# EAGLE design carte puissance 4PMOS (EAGLE 7.6.0)
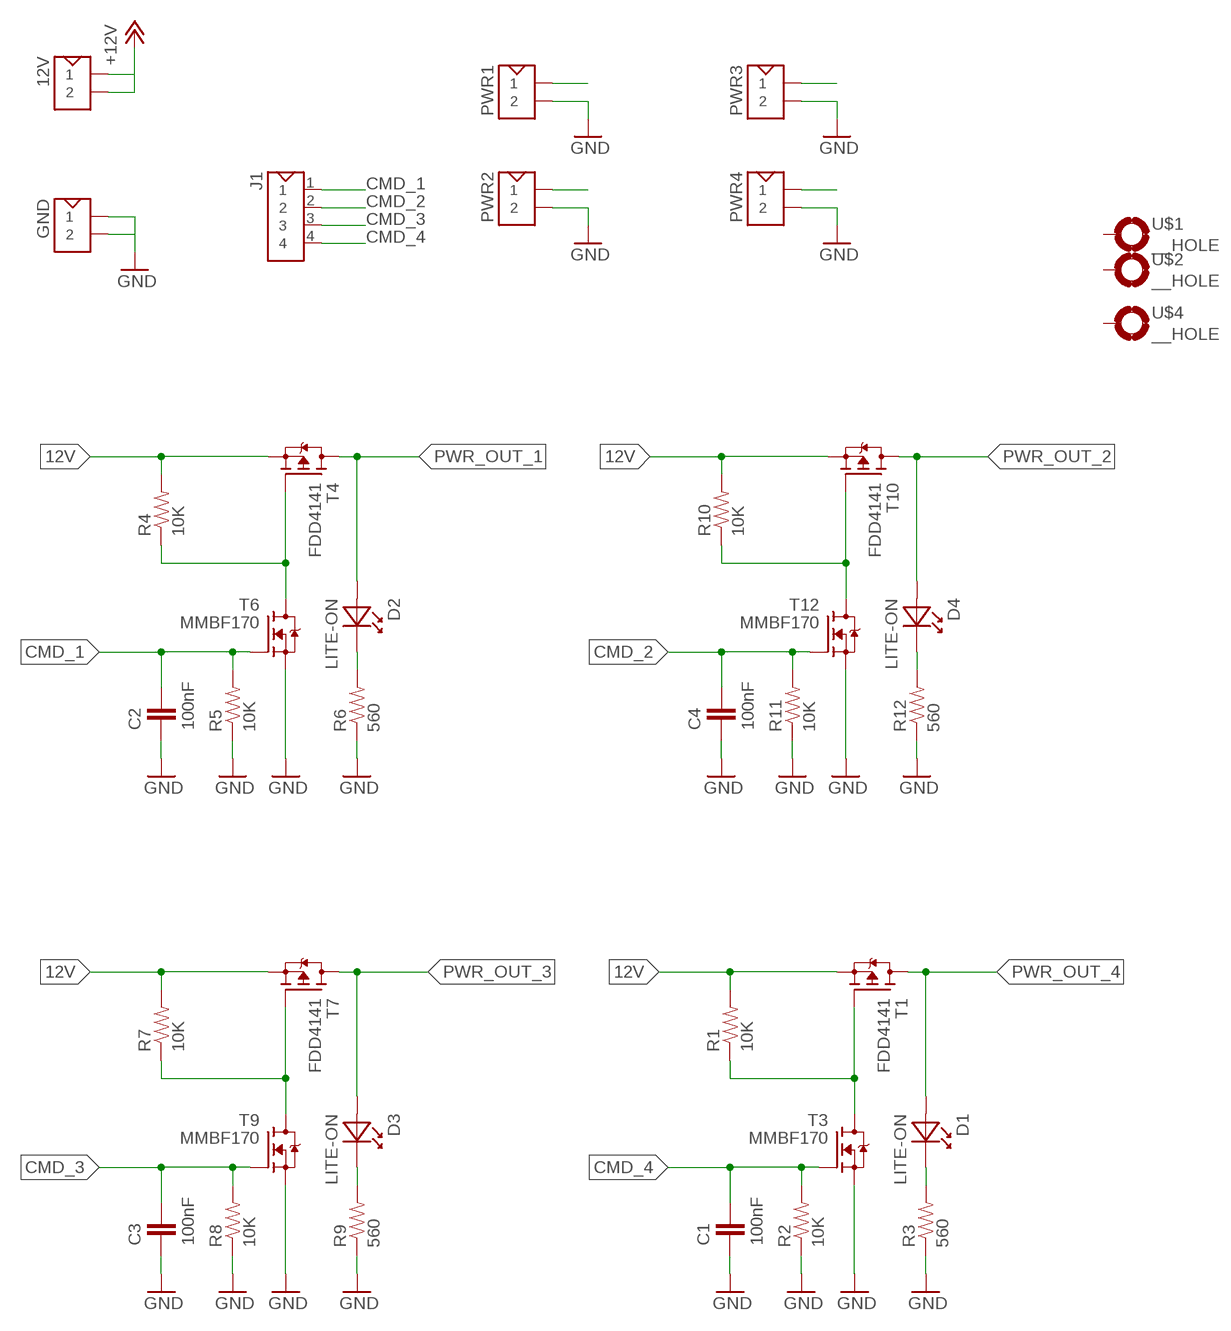
[diagram p0: schematic, sheet 1]

## Parts
12V  CON_2_BORNIER_A  [GMKDS_3_2-7.62]
C1  100nF  CAP0805  [0805]
C2  100nF  CAP0805  [0805]
C3  100nF  CAP0805  [0805]
C4  100nF  CAP0805  [0805]
D1  LITE-ON  LITE-ON_LTST-C170  [LITE-ON_LTST-C170]
D2  LITE-ON  LITE-ON_LTST-C170  [LITE-ON_LTST-C170]
D3  LITE-ON  LITE-ON_LTST-C170  [LITE-ON_LTST-C170]
D4  LITE-ON  LITE-ON_LTST-C170  [LITE-ON_LTST-C170]
GND  CON_2_BORNIER_A  [GMKDS_3_2-7.62]
J1  CON_4_JST  [B04B-XASK-1]
PWR1  CON_2_RS-PRO  [8971262]
PWR2  CON_2_RS-PRO  [8971262]
PWR3  CON_2_RS-PRO  [8971262]
PWR4  CON_2_RS-PRO  [8971262]
R1  10K  RESISTOR0805-RES  [0805]
R2  10K  RESISTOR0805-RES  [0805]
R3  560  RESISTOR0805-RES  [0805]
R4  10K  RESISTOR0805-RES  [0805]
R5  10K  RESISTOR0805-RES  [0805]
R6  560  RESISTOR0805-RES  [0805]
R7  10K  RESISTOR0805-RES  [0805]
R8  10K  RESISTOR0805-RES  [0805]
R9  560  RESISTOR0805-RES  [0805]
R10  10K  RESISTOR0805-RES  [0805]
R11  10K  RESISTOR0805-RES  [0805]
R12  560  RESISTOR0805-RES  [0805]
T1  FDD4141  PMOSFET_FDD4141  [D-PAC]
T3  MMBF170  NMOSFET_MMBF170LT1G  [SOT23]
T4  FDD4141  PMOSFET_FDD4141  [D-PAC]
T6  MMBF170  NMOSFET_MMBF170LT1G  [SOT23]
T7  FDD4141  PMOSFET_FDD4141  [D-PAC]
T9  MMBF170  NMOSFET_MMBF170LT1G  [SOT23]
T10  FDD4141  PMOSFET_FDD4141  [D-PAC]
T12  MMBF170  NMOSFET_MMBF170LT1G  [SOT23]
U$1  __HOLE  [__HOLE]
U$2  __HOLE  [__HOLE]
U$4  __HOLE  [__HOLE]

## Nets
12V: 12V.P$1 12V.P$2 R1.2 R4.2 R7.2 R10.2 T1.3(S) T4.3(S) T7.3(S) T10.3(S) ; supply symbol labelled +12V
CMD_1: C2.1 J1.1 R5.2 T6.1(G)
CMD_2: C4.1 J1.2 R11.2 T12.1(G)
CMD_3: C3.1 J1.3 R8.2 T9.1(G)
CMD_4: C1.1 J1.4 R2.2 T3.1(G)
GND: C1.2 C2.2 C3.2 C4.2 GND.P$1 GND.P$2 PWR1.2 PWR2.2 PWR3.2 PWR4.2 R2.1 R3.1 R5.1 R6.1 R8.1 R9.1 R11.1 R12.1 T3.2(S) T6.2(S) T9.2(S) T12.2(S)
N$1: R1.1 T1.1(G) T3.3(D)
N$3: D1.2(CATODE) R3.2
N$4: R4.1 T4.1(G) T6.3(D)
N$5: R7.1 T7.1(G) T9.3(D)
N$7: D3.2(CATODE) R9.2
N$9: D2.2(CATODE) R6.2
N$10: R10.1 T10.1(G) T12.3(D)
N$12: D4.2(CATODE) R12.2
PWR_OUT_1: D2.1(ANODE) PWR1.1 T4.4(D)
PWR_OUT_2: D4.1(ANODE) PWR2.1 T10.4(D)
PWR_OUT_3: D3.1(ANODE) PWR3.1 T7.4(D)
PWR_OUT_4: D1.1(ANODE) PWR4.1 T1.4(D)
Unconnected: U$1.P$1(MOUNT) U$1.P$2(MOUNT) U$1.P$3(MOUNT) U$1.P$4(MOUNT) U$1.P$5(MOUNT) U$1.P$6(MOUNT) U$1.P$7(MOUNT) U$1.P$8(MOUNT) U$1.P$9(MOUNT) U$2.P$1(MOUNT) U$2.P$2(MOUNT) U$2.P$3(MOUNT) U$2.P$4(MOUNT) U$2.P$5(MOUNT) U$2.P$6(MOUNT) U$2.P$7(MOUNT) U$2.P$8(MOUNT) U$2.P$9(MOUNT) U$4.P$1(MOUNT) U$4.P$2(MOUNT) U$4.P$3(MOUNT) U$4.P$4(MOUNT) U$4.P$5(MOUNT) U$4.P$6(MOUNT) U$4.P$7(MOUNT) U$4.P$8(MOUNT) U$4.P$9(MOUNT)

## Library data of the parts
12V GND = VALEO Proto Components:CON_2
C1-C4 = SparkFun:CAP: Capacitor Standard 0603 ceramic capacitor, and 0.1" leaded capacitor.
D1-D4 = VALEO Proto LEDs:LITE-ON_LTST-C170
J1 = V_PR_CONNECTORS:CON_4; RS: 602-7635
PWR1-PWR4 = V_PR_CONNECTORS:CON_2; RS: 897-1262 / (897-1219)
R1-R12 = SparkFun:RESISTOR: Resistor Basic schematic elements and footprints for 0603, 1206, and PTH resistors.
T1 T4 T7 T10 = VALEO Proto Components:PMOSFET
T3 T6 T9 T12 = VALEO Proto Components:NMOSFET
U$1 U$2 U$4 = VALEO Proto Components:__HOLE

## Board
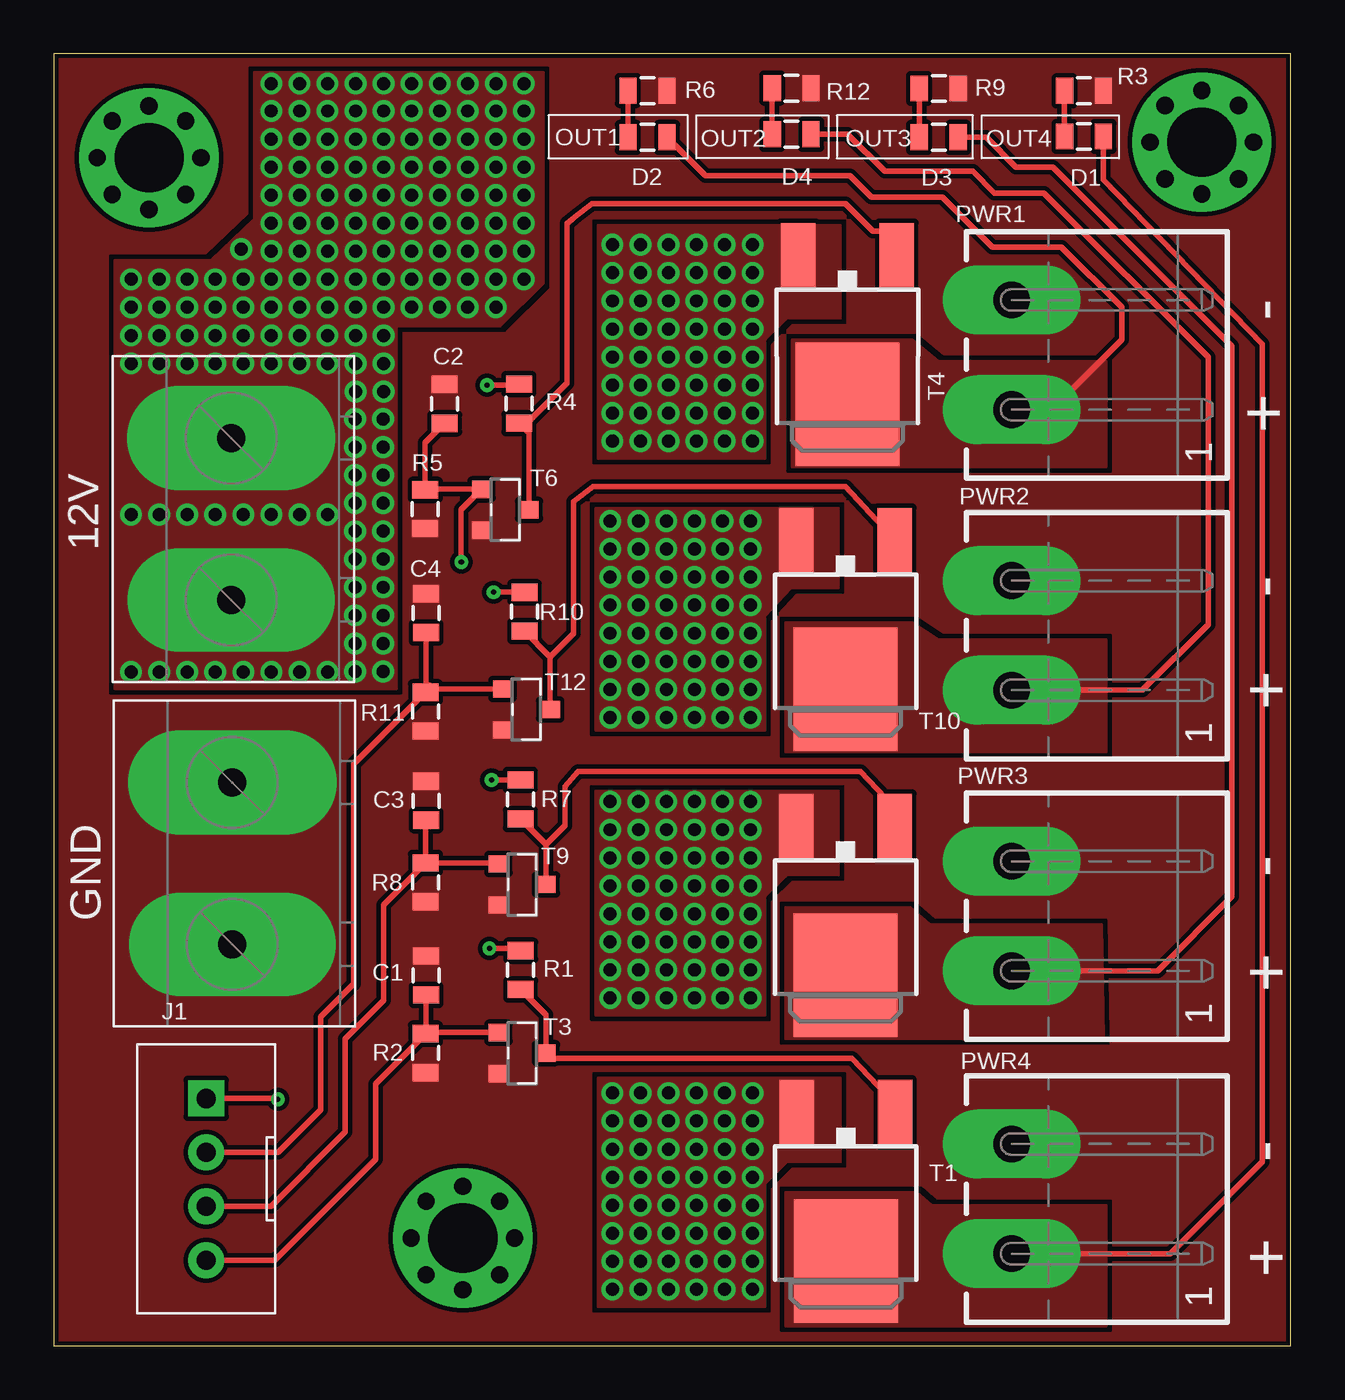
[diagram p1: board, top side]
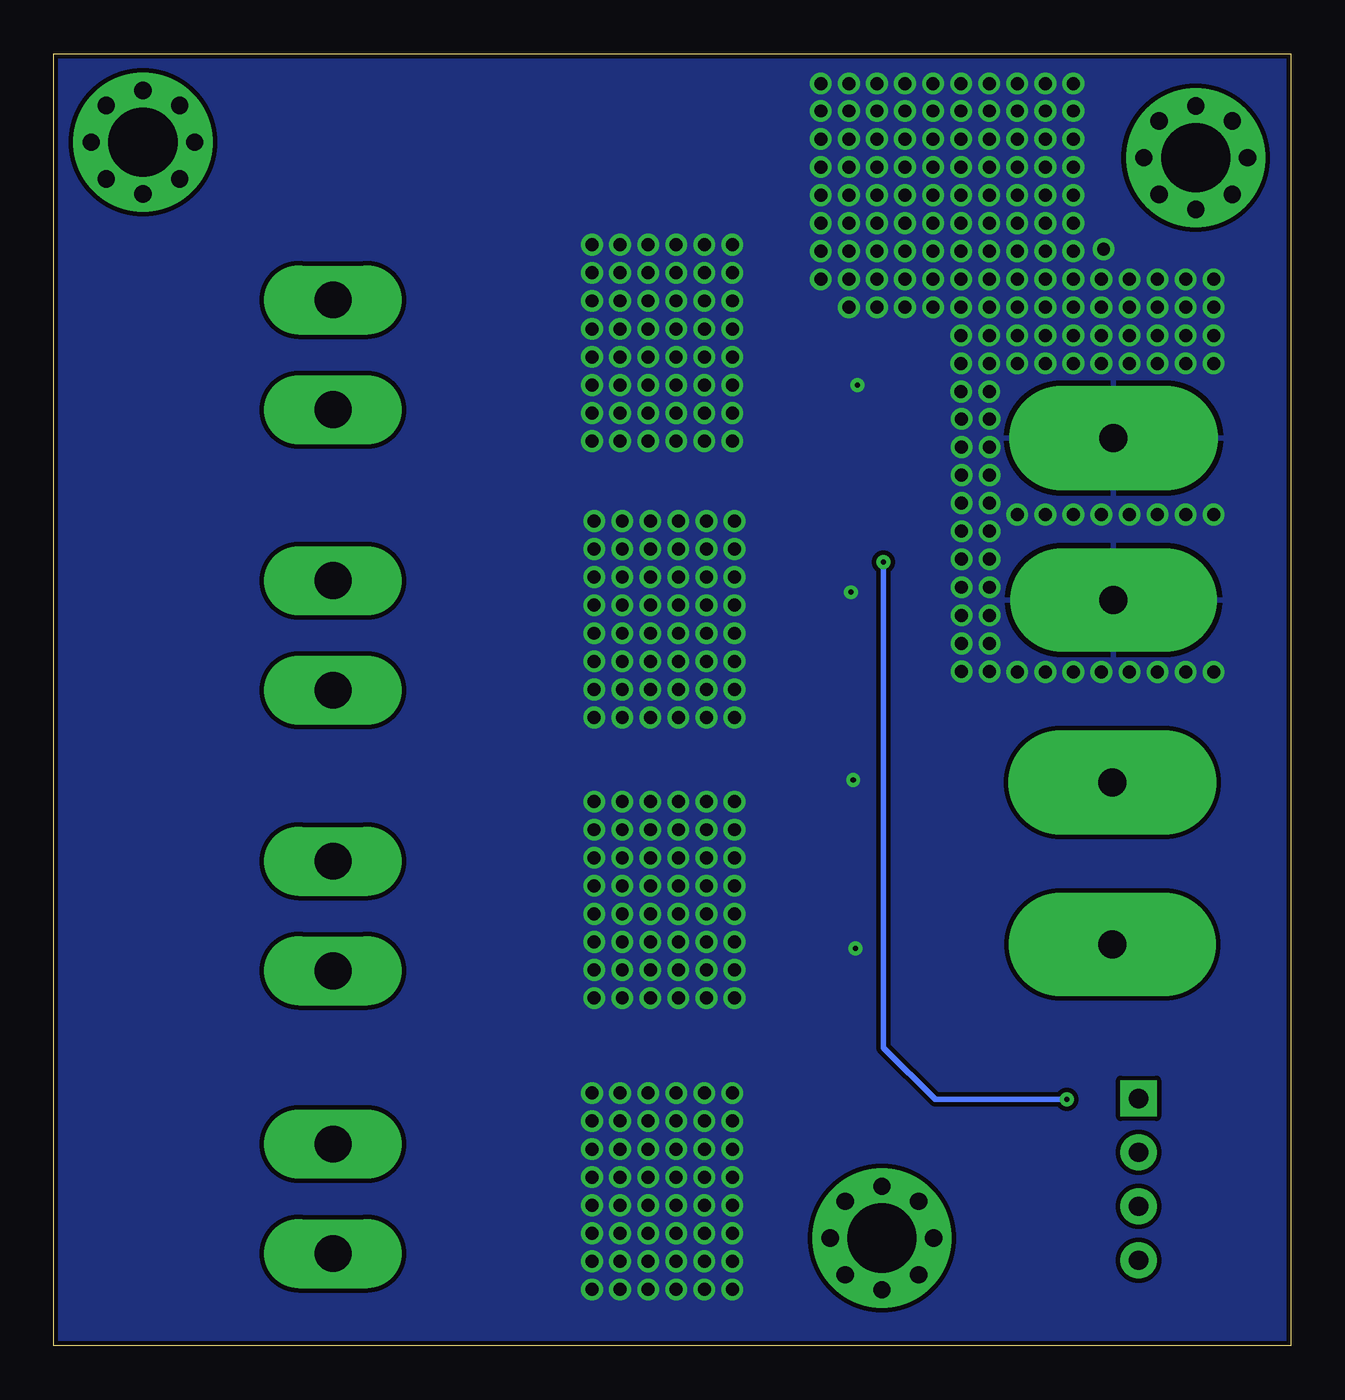
[diagram p2: board, bottom side, seen from below]

Size 57.3 x 59.84 mm. Coordinates in mm from the lower left corner, seen from the top.
Outline: 0,0 57.3,0 57.3,59.84 0,59.84 0,0
Copper layers (1*16): Top 0.07mm / dielectric 1mm / Bottom 0.07mm
Design rules "DRC_CL4 *": minimum track width 0.21mm, minimum drill 0.2mm, track to track 0.21mm, track to pad 0.21mm, pad to pad 0.21mm, via to via 0.21mm, smd to smd 0.21mm, copper to edge 0.21mm, drill to drill 0.21mm, minimum pad ring 10mil, minimum via ring 8mil, stop-mask expansion 4mil, vias tented up to drill 0mil, thermal gap 10mil

### Footprints (pad centres in the part's own frame; a part is rotated, then mirrored left to right if it is on the bottom)
GMKDS_3_2-7.62 = drill 1.3 pad 4.83 long: P$1 -3.8,0 | drill 1.3 pad 4.8 long: P$2 3.7,0
0805 = smd 0.8 x 1.2: 1 -0.9,0; 2 0.9,0
LITE-ON_LTST-C170 = smd 0.8 x 1.2: 1 -0.9,0; 2 0.9,0
B04B-XASK-1 = drill 0.9 pad 1.676 square: 1 -3.25,0 | drill 0.9 pad 1.676: 2 -0.75,0; 3 1.75,0; 4 4.25,0
8971262 = drill 1.7 pad 3.2 long: 1 -2.54,0; 2 2.54,0
D-PAC = smd 1.6 x 3: 1 -2.28,-4.04; 3 2.28,-4.04 | smd 4.826 x 5.715: 4 0,2.858
SOT23 = smd 0.8 x 0.9: 1 -0.95,-1.1; 2 0.95,-1.1; 3 0,1.1
__HOLE = drill 3.2 pad 6.452: P$1 0,0 | drill 0.8: P$2 0,2.4; P$3 1.7,1.7; P$4 2.4,0; P$5 0,-2.4; P$6 1.7,-1.7; P$7 -2.4,0; P$8 -1.7,1.7; P$9 -1.7,-1.7

### Placement (x,y rotation side)
12V  8.21,38.25 270 top
C1  17.24,17.15 90 top
C2  18.1,43.63 90 top
C3  17.24,25.24 90 top
C4  17.24,33.93 90 top
D1  47.72,56.02 180 top
D2  27.5,55.98 180 top
D3  40.99,55.98 180 top
D4  34.17,56.12 180 top
GND  8.26,22.29 270 top
J1  7.05,8.2 270 top
PWR1  44.37,45.9 90 top
PWR2  44.37,32.9 90 top
PWR3  44.37,19.9 90 top
PWR4  44.37,6.8 90 top
R1  21.62,17.4 90 top
R2  17.21,13.55 90 top
R3  47.72,58.13 180 top
R4  21.54,43.64 90 top
R5  17.2,38.75 90 top
R6  27.5,58.14 180 top
R7  21.61,25.3 90 top
R8  17.21,21.46 90 top
R9  40.99,58.24 180 top
R10  21.8,34 90 top
R11  17.21,29.37 90 top
R12  34.17,58.26 180 top
T1  36.69,6.77 180 top
T3  21.69,13.55 270 top
T4  36.76,46.47 180 top
T6  20.91,38.72 270 top
T7  36.67,20.02 180 top
T9  21.69,21.36 270 top
T10  36.67,33.27 180 top
T12  21.89,29.47 270 top
U$1  4.4,55.03 0 top
U$2  53.18,55.75 0 top
U$4  18.94,4.98 0 top

### Tracks (layer width: path | path; a pad name or v marks a point on that pad's centre or on a via)
12V  (via drill 0.23, 0.6 pad 0.81)
  Top 0.254: v20.07,44.5 21.5,44.5 R4.2 | v20.37,34.9 R10.2 | v20.27,26.2 R7.2 | v20.17,18.4 21.52,18.4 R1.2
  other vias: 15.27,53.3 10.07,53.3 11.37,53.3 12.67,53.3 13.97,53.3 10.07,54.6 11.37,54.6 12.67,54.6 13.97,54.6 15.27,54.6 10.07,55.9 11.37,55.9 12.67,55.9 13.97,55.9 15.27,55.9 10.07,57.2 11.37,57.2 12.67,57.2 13.97,57.2 15.27,57.2 21.77,50.7 16.57,50.7 17.87,50.7 19.17,50.7 20.47,50.7 16.57,52 17.87,52 19.17,52 20.47,52 21.77,52 15.27,50.7 11.37,50.7 12.67,50.7 13.97,50.7 10.07,52 11.37,52 12.67,52 13.97,52 15.27,52 21.77,53.3 16.57,53.3 17.87,53.3 19.17,53.3 20.47,53.3 16.57,54.6 17.87,54.6 19.17,54.6 20.47,54.6 21.77,54.6 16.57,55.9 17.87,55.9 19.17,55.9 20.47,55.9 21.77,55.9 16.57,57.2 17.87,57.2 19.17,57.2 20.47,57.2 21.77,57.2 21.77,49.4 16.57,49.4 17.87,49.4 19.17,49.4 20.47,49.4 15.27,49.4 13.97,49.4 16.57,48.1 17.87,48.1 19.17,48.1 20.47,48.1 15.27,48.1 13.97,48.1 15.27,46.8 13.97,46.8 15.27,45.5 13.97,45.5 15.27,44.2 13.97,44.2 10.07,50.7 8.67,50.8 6.17,45.5 3.57,45.5 4.87,45.5 3.57,46.8 4.87,46.8 6.17,46.8 3.57,48.1 4.87,48.1 6.17,48.1 3.57,49.4 4.87,49.4 6.17,49.4 12.67,45.5 7.47,45.5 8.77,45.5 10.07,45.5 11.37,45.5 7.47,46.8 8.77,46.8 10.07,46.8 11.37,46.8 12.67,46.8 7.47,48.1 8.77,48.1 10.07,48.1 11.37,48.1 12.67,48.1 7.47,49.4 8.77,49.4 10.07,49.4 11.37,49.4 12.67,49.4 3.57,38.5 4.87,38.5 6.17,38.5 7.47,38.5 8.77,38.5 10.07,38.5 11.37,38.5 15.25,39.03 13.95,39.03 13.95,40.33 15.25,40.33 13.95,41.63 15.25,41.63 13.95,42.93 15.25,42.93 15.25,36.43 13.95,36.43 13.95,37.73 15.25,37.73 15.25,35.13 13.95,35.13 15.25,33.83 13.95,33.83 15.25,32.53 13.95,32.53 15.25,31.23 13.95,31.23 12.67,38.5 3.57,31.2 4.87,31.2 6.17,31.2 7.47,31.2 8.77,31.2 10.07,31.2 11.37,31.2 12.67,31.2 27.17,7.8 25.87,7.8 25.87,9.1 27.17,9.1 25.87,10.4 27.17,10.4 25.87,11.7 27.17,11.7 28.47,5.2 29.77,5.2 31.07,5.2 32.37,5.2 28.47,6.5 29.77,6.5 31.07,6.5 32.37,6.5 27.17,5.2 25.87,5.2 25.87,6.5 27.17,6.5 28.47,7.8 29.77,7.8 31.07,7.8 32.37,7.8 28.47,9.1 29.77,9.1 31.07,9.1 32.37,9.1 28.47,10.4 29.77,10.4 31.07,10.4 32.37,10.4 28.47,11.7 29.77,11.7 31.07,11.7 32.37,11.7 28.47,3.9 29.77,3.9 31.07,3.9 32.37,3.9 27.17,3.9 25.87,3.9 28.47,2.6 29.77,2.6 31.07,2.6 32.37,2.6 27.17,2.6 25.87,2.6 27.17,47.1 25.87,47.1 25.87,48.4 27.17,48.4 25.87,49.7 27.17,49.7 25.87,51 27.17,51 28.47,44.5 29.77,44.5 31.07,44.5 32.37,44.5 28.47,45.8 29.77,45.8 31.07,45.8 32.37,45.8 27.17,44.5 25.87,44.5 25.87,45.8 27.17,45.8 28.47,47.1 29.77,47.1 31.07,47.1 32.37,47.1 28.47,48.4 29.77,48.4 31.07,48.4 32.37,48.4 28.47,49.7 29.77,49.7 31.07,49.7 32.37,49.7 28.47,51 29.77,51 31.07,51 32.37,51 28.47,43.2 29.77,43.2 31.07,43.2 32.37,43.2 27.17,43.2 25.87,43.2 28.47,41.9 29.77,41.9 31.07,41.9 32.37,41.9 27.17,41.9 25.87,41.9 27.07,34.3 25.77,34.3 25.77,35.6 27.07,35.6 25.77,36.9 27.07,36.9 25.77,38.2 27.07,38.2 28.37,31.7 29.67,31.7 30.97,31.7 32.27,31.7 28.37,33 29.67,33 30.97,33 32.27,33 27.07,31.7 25.77,31.7 25.77,33 27.07,33 28.37,34.3 29.67,34.3 30.97,34.3 32.27,34.3 28.37,35.6 29.67,35.6 30.97,35.6 32.27,35.6 28.37,36.9 29.67,36.9 30.97,36.9 32.27,36.9 28.37,38.2 29.67,38.2 30.97,38.2 32.27,38.2 28.37,30.4 29.67,30.4 30.97,30.4 32.27,30.4 27.07,30.4 25.77,30.4 28.37,29.1 29.67,29.1 30.97,29.1 32.27,29.1 27.07,29.1 25.77,29.1 27.07,21.3 25.77,21.3 25.77,22.6 27.07,22.6 25.77,23.9 27.07,23.9 25.77,25.2 27.07,25.2 28.37,18.7 29.67,18.7 30.97,18.7 32.27,18.7 28.37,20 29.67,20 30.97,20 32.27,20 27.07,18.7 25.77,18.7 25.77,20 27.07,20 28.37,21.3 29.67,21.3 30.97,21.3 32.27,21.3 28.37,22.6 29.67,22.6 30.97,22.6 32.27,22.6 28.37,23.9 29.67,23.9 30.97,23.9 32.27,23.9 28.37,25.2 29.67,25.2 30.97,25.2 32.27,25.2 28.37,17.4 29.67,17.4 30.97,17.4 32.27,17.4 27.07,17.4 25.77,17.4 28.37,16.1 29.67,16.1 30.97,16.1 32.27,16.1 27.07,16.1 25.77,16.1 10.07,58.47 11.37,58.47 12.67,58.47 13.97,58.47 15.27,58.47 16.57,58.47 17.87,58.47 19.17,58.47 20.47,58.47 21.77,58.47
  pour Bottom: -1.73,61.8 -1.73,-2.3 63.27,-2.3 63.27,61.8
  pour Top (no thermals): 2.82,30.4 2.82,50.3 7.27,50.3 9.27,52.2 9.27,59.02 22.67,59.02 22.67,49.2 20.67,47.2 15.87,47.2 15.87,30.4
  pour Top (no thermals): 36.47,12.4 25.17,12.4 25.17,1.8 32.97,1.8 32.97,7.5 33.97,8.5 36.47,8.5
  pour Top (no thermals): 36.47,51.9 25.17,51.9 25.17,41.1 32.97,41.1 32.97,46.6 33.97,47.6 36.47,47.6
  pour Top (no thermals): 36.37,38.8 25.07,38.8 25.07,28.5 32.97,28.5 32.97,33.8 34.17,35.1 36.37,35.1
  pour Top (no thermals): 36.37,25.7 25.07,25.7 25.07,15.3 32.97,15.3 32.97,20.8 33.97,21.8 36.37,21.8
CMD_1  (via drill 0.23)
  Top 0.254: 17.22,39.67 T6.1 18.87,38.73 v18.87,36.3 | C2.1 17.2,41.83 R5.2 | J1.1 10.32,11.45 v10.37,11.4
  Top 0.61: R5.2 17.22,39.67
  Bottom 0.254: v10.37,11.4 16.47,11.4 18.87,13.8 v18.87,36.3
CMD_2
  Top 0.254: 17.36,30.42 T12.1 | 17.24,30.3 C4.1 | J1.2 10.39,8.95 12.35,10.91 12.35,15.23 13.88,16.75 13.88,26.93 R11.2
  Top 0.61: 17.36,30.42 R11.2 17.24,30.3
CMD_3
  Top 0.254: R8.2 17.21,24.31 | R8.2 20.54,22.36 | J1.3 10.05,6.45 13.5,9.89 13.5,14.21 15.27,15.99 15.27,20.42 R8.2
  Top 0.61: 17.21,24.31 C3.1 | 20.54,22.36 T9.1
CMD_4
  Top 0.254: 17.24,14.48 C1.1 | 17.26,14.5 T3.1 | J1.4 10.22,3.95 14.89,8.62 14.89,12.13 R2.2
  Top 0.61: R2.2 17.24,14.48 17.26,14.5
GND
  pour Top (rank 6, no thermals): -1.47,61.04 57.96,61.04 57.96,-0.37 -1.47,-0.37
N$1
  Top 0.254: R1.1 22.79,15.33 T3.3 23.14,13.3 36.97,13.3 38.97,11.2 T1.1
N$3
  Top 0.254: D1.2 R3.2
N$4
  Top 0.254: T6.3 22.01,42.27 R4.1 21.91,42.74 23.77,44.6 23.77,51.95 24.11,52.29 | T4.1 39.04,51.63 37.94,51.63 36.67,52.9 24.93,52.9 24.11,52.29 | 24.11,52.29 23.77,52
N$5
  Top 0.254: T9.3 22.79,23.22 | 22.79,23.22 R7.1 | 22.79,23.22 23.67,24.1 23.67,25.9 24.27,26.6 37.37,26.6 38.95,24.92 T7.1
N$7
  Top 0.254: D3.2 R9.2
N$9
  Top 0.254: D2.2 R6.2
N$10
  Top 0.254: T12.3 22.99,31.91 | 22.99,31.91 R10.1 | 22.99,31.91 24.07,32.99 24.07,39.1 24.97,39.8 36.66,39.8 T10.1
N$12
  Top 0.254: D4.2 R12.2
PWR_OUT_1
  Top 0.254: D2.1 30.18,54.2 36.87,54.2 37.87,53.2 41.17,53.2 43.47,50.9 46.67,50.9 49.47,48.1 49.47,46.6 46.23,43.36 PWR1.1
  pour Top (no thermals): 34.17,46.6 34.17,40.7 48.77,40.7 48.77,45.6 40.97,45.6 39.77,46.6
PWR_OUT_2
  Top 0.254: D4.1 36.77,56.12 38.49,54.4 42.57,54.4 43.57,53.4 45.87,53.4 53.47,45.8 53.47,33.4 50.43,30.36 PWR2.1
  pour Top (no thermals): 33.87,33.5 33.87,27.5 48.77,27.5 48.77,32.7 40.97,32.7 39.77,33.5
PWR_OUT_3
  Top 0.254: D3.1 43.19,55.98 44.57,54.6 46.27,54.6 54.57,46.3 54.57,20.8 51.13,17.36 PWR3.1
  pour Top (no thermals): 33.87,20.3 33.87,14.2 48.67,14.2 48.57,19.5 40.57,19.5 39.67,20.3
PWR_OUT_4
  Top 0.254: PWR4.1 51.73,4.26 55.97,8.5 55.97,46.4 48.62,54 D1.1
  pour Top (no thermals): 33.87,7.1 33.87,0.9 48.77,0.9 48.77,6.5 40.67,6.5 39.97,7.1

### Text on the board
tPlace: OUT1 | OUT2 | OUT3 | OUT4 | - | + | - | + | - | + | - | +